# Altium project ICAN-7006-USB.PrjPCB
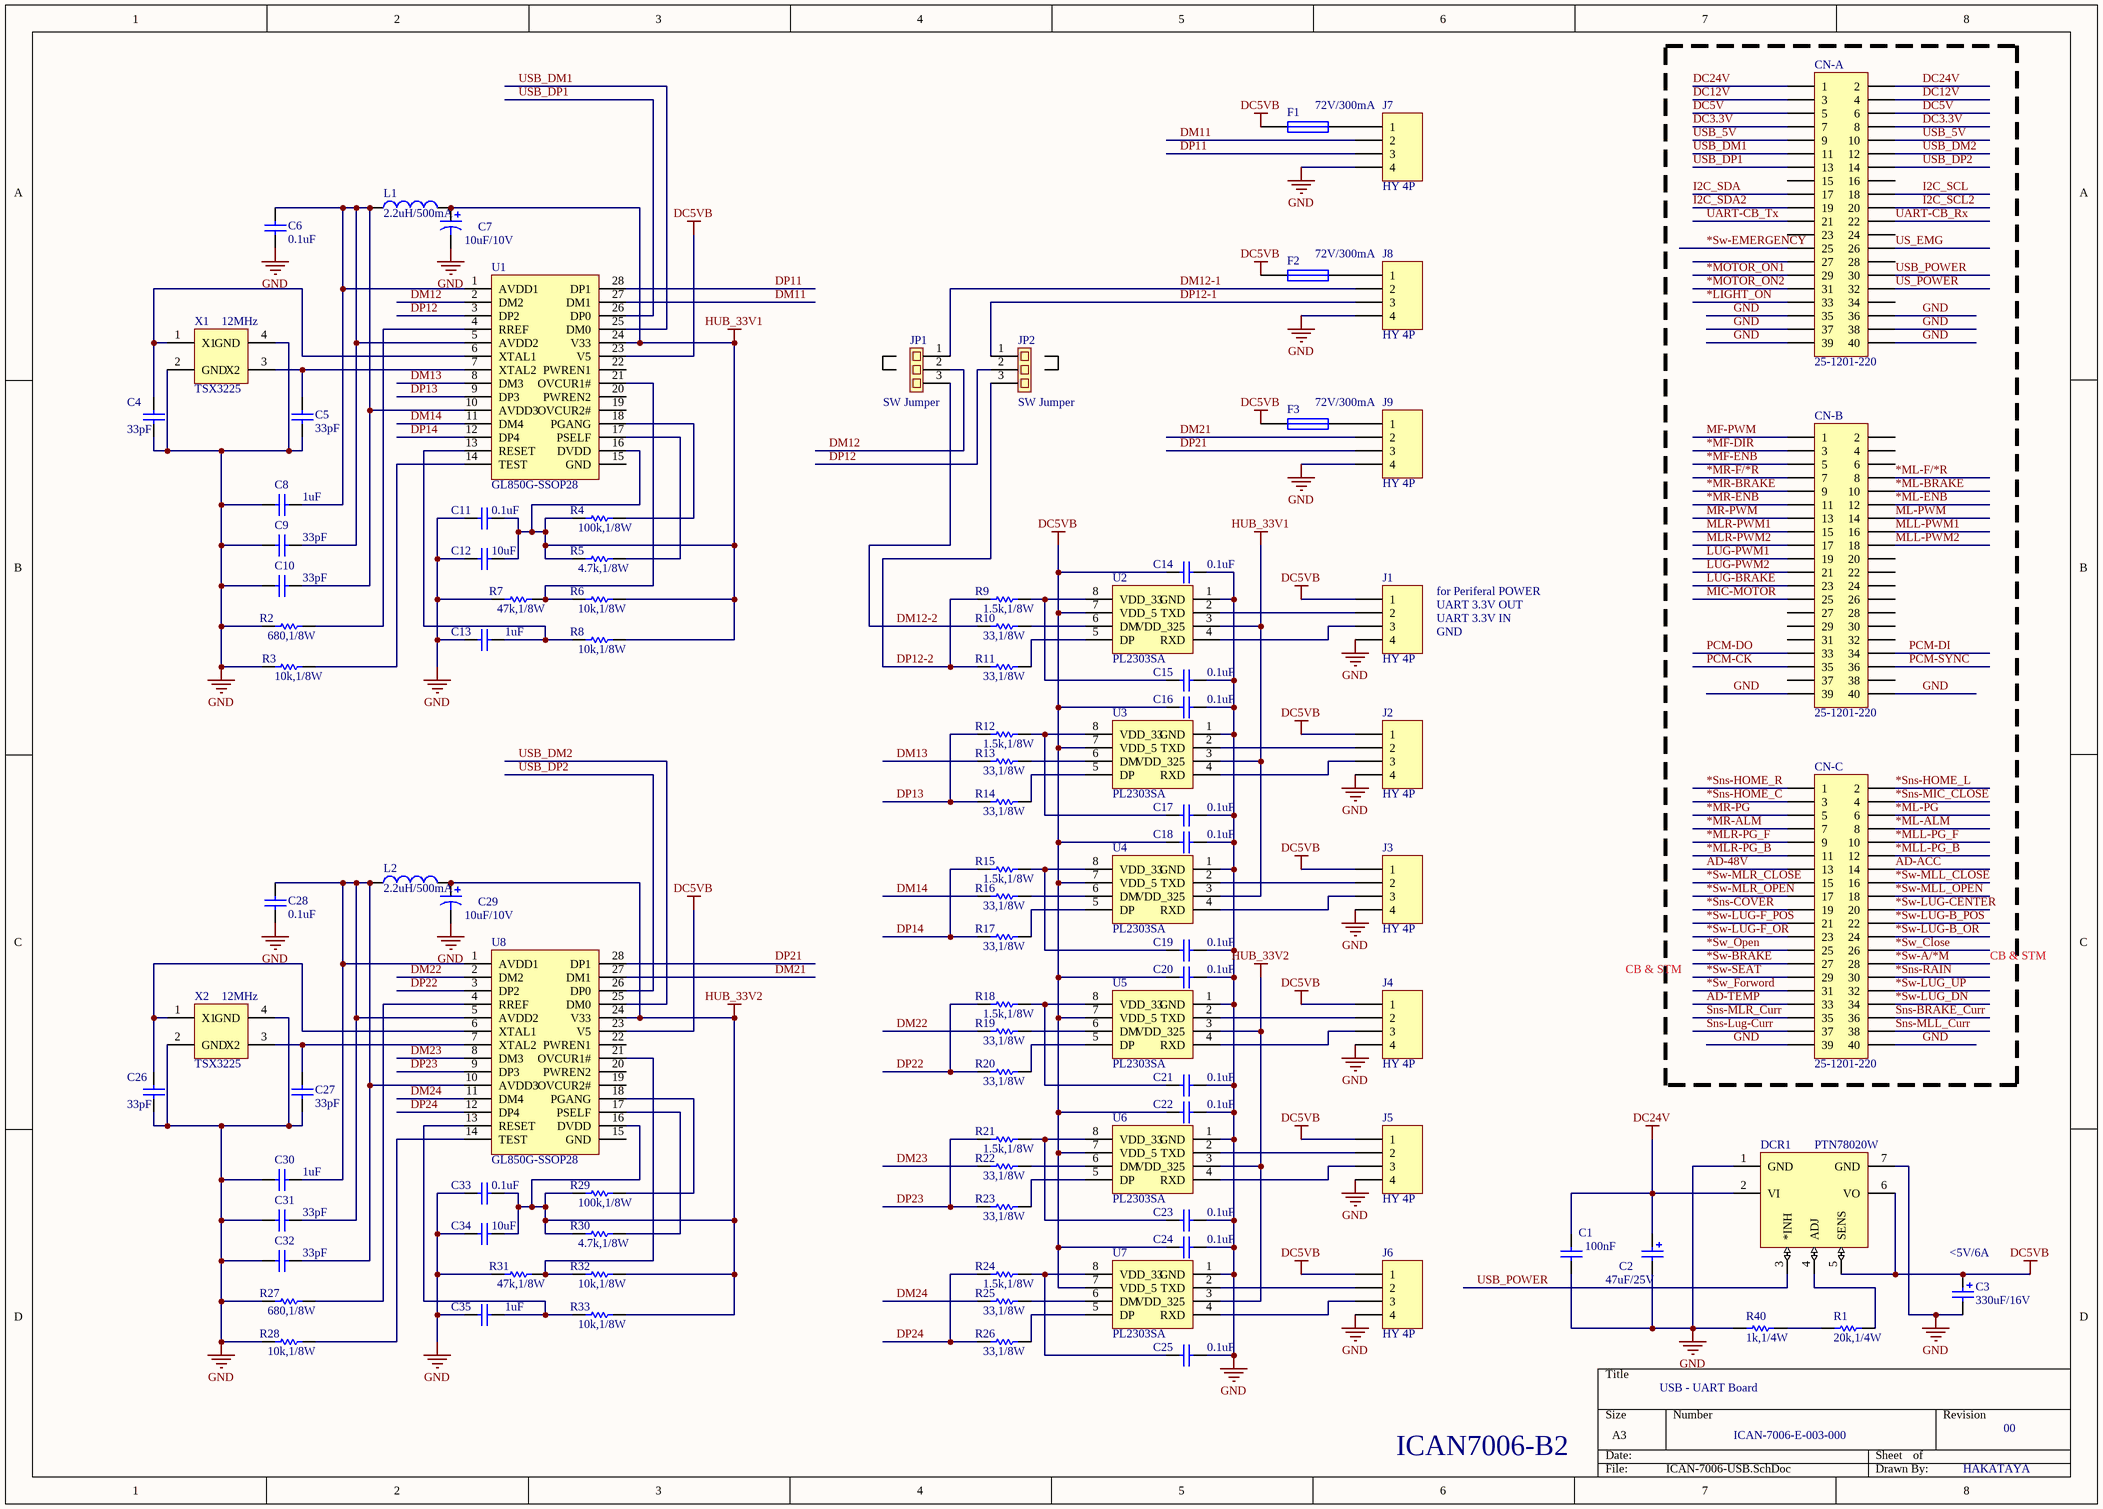
[diagram p0: ICAN-7006-USB.SchDoc]
1 sheet, 99 parts. Net scope: global (net labels, ports and power ports of the same name join across sheets).
Board file: ICAN-7006-USB.PcbDoc

## Sheet ICAN-7006-USB.SchDoc
size A3; PageSetup: Record=PageOptions|CenterHorizontal=True|CenterVertical=True|PrintScale=1.04|XCorrection=1.00|YCorrection=1.00|PrintKind=0|BorderSize=5000000|LeftOffset=0|BottomOffset=0|Orientation=2|PaperLength=1000|PaperWidth=1000|Scale=100|PaperSource=7|PrintQuality=-4|MediaType=1|DitherType=10|PaperKind=A3|PrintScaleMode=1

### Parts
C1  100nF  [[0805]2012]
C2  47uF/25V  [Capa MH5 PITCH2.5mm]
C3  330uF/16V  [CAPA WXA PITCH 3.5mm]
C4  33pF  [[0805]2012]
C5  33pF  [[0805]2012]
C6  0.1uF  [[0805]2012]
C7  10uF/10V  [[0805]2012]
C8  1uF  [[0805]2012]
C9  33pF  [[0805]2012]
C10  33pF  [[0805]2012]
C11  0.1uF  [[0805]2012]
C12  10uF  [[0805]2012]
C13  1uF  [[0805]2012]
C14  0.1uF  [[0805]2012]
C15  0.1uF  [[0805]2012]
C16  0.1uF  [[0805]2012]
C17  0.1uF  [[0805]2012]
C18  0.1uF  [[0805]2012]
C19  0.1uF  [[0805]2012]
C20  0.1uF  [[0805]2012]
C21  0.1uF  [[0805]2012]
C22  0.1uF  [[0805]2012]
C23  0.1uF  [[0805]2012]
C24  0.1uF  [[0805]2012]
C25  0.1uF  [[0805]2012]
C26  33pF  [[0805]2012]
C27  33pF  [[0805]2012]
C28  0.1uF  [[0805]2012]
C29  10uF/10V  [[0805]2012]
C30  1uF  [[0805]2012]
C31  33pF  [[0805]2012]
C32  33pF  [[0805]2012]
C33  0.1uF  [[0805]2012]
C34  10uF  [[0805]2012]
C35  1uF  [[0805]2012]
CN-A  25-1201-220  [HDR2X20]
CN-B  25-1201-220  [HDR2X20]
CN-C  25-1201-220  [HDR2X20]
DCR1  PTN78020W  [PTN78020]
F1  72V/300mA  [CAPR5-4X5]
F2  72V/300mA  [CAPR5-4X5]
F3  72V/300mA  [CAPR5-4X5]
J1  HY 4P  [HY-4AW]
J2  HY 4P  [HY-4AW]
J3  HY 4P  [HY-4AW]
J4  HY 4P  [HY-4AW]
J5  HY 4P  [HY-4AW]
J6  HY 4P  [HY-4AW]
J7  HY 4P  [HY-4AW]
J8  HY 4P  [HY-4AW]
J9  HY 4P  [HY-4AW]
JP1  SW Jumper  [VR]
JP2  SW Jumper  [VR]
L1  2.2uH/500mA  [[0805]2012]
L2  2.2uH/500mA  [[0805]2012]
R1  20k,1/4W  [[1206]3216]
R2  680,1/8W  [[0805]2012]
R3  10k,1/8W  [[0805]2012]
R4  100k,1/8W  [[0805]2012]
R5  4.7k,1/8W  [[0805]2012]
R6  10k,1/8W  [[0805]2012]
R7  47k,1/8W  [[0805]2012]
R8  10k,1/8W  [[0805]2012]
R9  1.5k,1/8W  [[0805]2012]
R10  33,1/8W  [[0805]2012]
R11  33,1/8W  [[0805]2012]
R12  1.5k,1/8W  [[0805]2012]
R13  33,1/8W  [[0805]2012]
R14  33,1/8W  [[0805]2012]
R15  1.5k,1/8W  [[0805]2012]
R16  33,1/8W  [[0805]2012]
R17  33,1/8W  [[0805]2012]
R18  1.5k,1/8W  [[0805]2012]
R19  33,1/8W  [[0805]2012]
R20  33,1/8W  [[0805]2012]
R21  1.5k,1/8W  [[0805]2012]
R22  33,1/8W  [[0805]2012]
R23  33,1/8W  [[0805]2012]
R24  1.5k,1/8W  [[0805]2012]
R25  33,1/8W  [[0805]2012]
R26  33,1/8W  [[0805]2012]
R27  680,1/8W  [[0805]2012]
R28  10k,1/8W  [[0805]2012]
R29  100k,1/8W  [[0805]2012]
R30  4.7k,1/8W  [[0805]2012]
R31  47k,1/8W  [[0805]2012]
R32  10k,1/8W  [[0805]2012]
R33  10k,1/8W  [[0805]2012]
R40  1k,1/4W  [[1206]3216]
U1  GL850G-SSOP28  [SSOP-28]
U2  PL2303SA  [SOIC150-8_L]
U3  PL2303SA  [SOIC150-8_L]
U4  PL2303SA  [SOIC150-8_L]
U5  PL2303SA  [SOIC150-8_L]
U6  PL2303SA  [SOIC150-8_L]
U7  PL2303SA  [SOIC150-8_L]
U8  GL850G-SSOP28  [SSOP-28]
X1  TSX3225  [XTAL 3225]
X2  TSX3225  [XTAL 3225]

### Blocks framed on the sheet
CB & STM: CN-A CN-B CN-C

### Nets
DC5VB: C3.1 C14.1 C16.1 C18.1 C20.1 C22.1 C24.1 DCR1.5(SENS) DCR1.6(VO) F1.1 F2.1 F3.1 J1.1 J2.1 J3.1 J4.1 J5.1 J6.1 U1.23(V5) U2.7(VDD_5) U3.7(VDD_5) U4.7(VDD_5) U5.7(VDD_5) U6.7(VDD_5) U7.7(VDD_5) U8.23(V5)
DC24V: C1.2 C2.1 CN-A.1 CN-A.2 DCR1.2(VI)
GND: C1.1 C2.2 C3.2 C4.1 C5.1 C6.1 C7.2 C8.1 C9.1 C10.1 C11.1 C12.1 C13.1 C14.2 C15.2 C16.2 C17.2 C18.2 C19.2 C20.2 C21.2 C22.2 C23.2 C24.2 C25.2 C26.1 C27.1 C28.1 C29.2 C30.1 C31.1 C32.1 C33.1 C34.1 C35.1 CN-A.35 CN-A.36 CN-A.37 CN-A.38 CN-A.39 CN-A.40 CN-B.39 CN-B.40 CN-C.39 CN-C.40 DCR1.1(GND) DCR1.7(GND) J1.4 J2.4 J3.4 J4.4 J5.4 J6.4 J7.4 J8.4 J9.4 R2.1 R3.1 R7.1 R27.1 R28.1 R31.1 R40.1 U2.1(GND) U3.1(GND) U4.1(GND) U5.1(GND) U6.1(GND) U7.1(GND) X1.2(GND) X1.4(GND) X2.2(GND) X2.4(GND)
HUB_33V1: C7.1 C11.2 C12.2 L1.2 R4.1 R5.1 R6.2 R8.2 U1.16(DVDD) U1.24(V33) U2.3(VDD_325) U3.3(VDD_325) U4.3(VDD_325)
HUB_33V2: C29.1 C33.2 C34.2 L2.2 R29.1 R30.1 R32.2 R33.2 U5.3(VDD_325) U6.3(VDD_325) U7.3(VDD_325) U8.16(DVDD) U8.24(V33)
*LIGHT_ON: CN-A.33
*MF-DIR: CN-B.3
*MF-ENB: CN-B.5
*ML-ALM: CN-C.8
*ML-BRAKE: CN-B.10
*ML-ENB: CN-B.12
*ML-F/*R: CN-B.8
*ML-PG: CN-C.6
*MLL-PG_B: CN-C.12
*MLL-PG_F: CN-C.10
*MLR-PG_B: CN-C.11
*MLR-PG_F: CN-C.9
*MOTOR_ON1: CN-A.29
*MOTOR_ON2: CN-A.31
*MR-ALM: CN-C.7
*MR-BRAKE: CN-B.9
*MR-ENB: CN-B.11
*MR-F/*R: CN-B.7
*MR-PG: CN-C.5
*Sns-COVER: CN-C.19
*Sns-HOME_C: CN-C.3
*Sns-HOME_L: CN-C.2
*Sns-HOME_R: CN-C.1
*Sns-MIC_CLOSE: CN-C.4
*Sns-RAIN: CN-C.30
*Sw-A/*M: CN-C.28
*Sw-BRAKE: CN-C.27
*Sw-EMERGENCY: CN-A.25
*Sw-LUG-B_OR: CN-C.24
*Sw-LUG-B_POS: CN-C.22
*Sw-LUG-CENTER: CN-C.20
*Sw-LUG-F_OR: CN-C.23
*Sw-LUG-F_POS: CN-C.21
*Sw-LUG_DN: CN-C.34
*Sw-LUG_UP: CN-C.32
*Sw-MLL_CLOSE: CN-C.16
*Sw-MLL_OPEN: CN-C.18
*Sw-MLR_CLOSE: CN-C.15
*Sw-MLR_OPEN: CN-C.17
*Sw-SEAT: CN-C.29
*Sw_Close: CN-C.26
*Sw_Forword: CN-C.31
*Sw_Open: CN-C.25
AD-48V: CN-C.13
AD-ACC: CN-C.14
AD-TEMP: CN-C.33
DC3.3V: CN-A.7 CN-A.8
DC5V: CN-A.5 CN-A.6
DC12V: CN-A.3 CN-A.4
DM11: J7.2 U1.27(DM1)
DM12: JP1.2 U1.2(DM2)
DM12-1: J8.2 JP1.1
DM12-2: JP1.3 R10.1
DM13: R13.1 U1.8(DM3)
DM14: R16.1 U1.11(DM4)
DM21: J9.2 U8.27(DM1)
DM22: R19.1 U8.2(DM2)
DM23: R22.1 U8.8(DM3)
DM24: R25.1 U8.11(DM4)
DP11: J7.3 U1.28(DP1)
DP12: JP2.2 U1.3(DP2)
DP12-1: J8.3 JP2.1
DP12-2: JP2.3 R9.1 R11.1
DP13: R12.1 R14.1 U1.9(DP3)
DP14: R15.1 R17.1 U1.12(DP4)
DP21: J9.3 U8.28(DP1)
DP22: R18.1 R20.1 U8.3(DP2)
DP23: R21.1 R23.1 U8.9(DP3)
DP24: R24.1 R26.1 U8.12(DP4)
I2C_SCL: CN-A.18
I2C_SCL2: CN-A.20
I2C_SDA: CN-A.17
I2C_SDA2: CN-A.19
LUG-BRAKE: CN-B.23
LUG-PWM1: CN-B.19
LUG-PWM2: CN-B.21
MF-PWM: CN-B.1
MIC-MOTOR: CN-B.25
ML-PWM: CN-B.14
MLL-PWM1: CN-B.16
MLL-PWM2: CN-B.18
MLR-PWM1: CN-B.15
MLR-PWM2: CN-B.17
MR-PWM: CN-B.13
PCM-CK: CN-B.35
PCM-DI: CN-B.34
PCM-DO: CN-B.33
PCM-SYNC: CN-B.36
Sns-BRAKE_Curr: CN-C.36
Sns-Lug-Curr: CN-C.37
Sns-MLL_Curr: CN-C.38
Sns-MLR_Curr: CN-C.35
UART-CB_Rx: CN-A.22
UART-CB_Tx: CN-A.21
US_EMG: CN-A.26
US_POWER: CN-A.32
USB_5V: CN-A.9 CN-A.10
USB_DM1: CN-A.11 U1.25(DM0)
USB_DM2: CN-A.12 U8.25(DM0)
USB_DP1: CN-A.13 U1.26(DP0)
USB_DP2: CN-A.14 U8.26(DP0)
USB_POWER: CN-A.30 DCR1.3(*INH)
NetC4_2: C4.2 U1.6(XTAL1) X1.1(X1)
NetC5_2: C5.2 U1.7(XTAL2) X1.3(X2)
NetC6_2: C6.2 C8.2 C9.2 C10.2 L1.1 U1.1(AVDD1) U1.5(AVDD2) U1.10(AVDD3)
NetC13_2: C13.2 R8.1 U1.13(RESET)
NetC15_1: C15.1 R9.2 U2.8(VDD_33)
NetC17_1: C17.1 R12.2 U3.8(VDD_33)
NetC19_1: C19.1 R15.2 U4.8(VDD_33)
NetC21_1: C21.1 R18.2 U5.8(VDD_33)
NetC23_1: C23.1 R21.2 U6.8(VDD_33)
NetC25_1: C25.1 R24.2 U7.8(VDD_33)
NetC26_2: C26.2 U8.6(XTAL1) X2.1(X1)
NetC27_2: C27.2 U8.7(XTAL2) X2.3(X2)
NetC28_2: C28.2 C30.2 C31.2 C32.2 L2.1 U8.1(AVDD1) U8.5(AVDD2) U8.10(AVDD3)
NetC35_2: C35.2 R33.1 U8.13(RESET)
NetDCR1_4: DCR1.4(ADJ) R1.2
NetF1_2: F1.2 J7.1
NetF2_2: F2.2 J8.1
NetF3_2: F3.2 J9.1
NetJ1_2: J1.2 U2.2(TXD)
NetJ1_3: J1.3 U2.4(RXD)
NetJ2_2: J2.2 U3.2(TXD)
NetJ2_3: J2.3 U3.4(RXD)
NetJ3_2: J3.2 U4.2(TXD)
NetJ3_3: J3.3 U4.4(RXD)
NetJ4_2: J4.2 U5.2(TXD)
NetJ4_3: J4.3 U5.4(RXD)
NetJ5_2: J5.2 U6.2(TXD)
NetJ5_3: J5.3 U6.4(RXD)
NetJ6_2: J6.2 U7.2(TXD)
NetJ6_3: J6.3 U7.4(RXD)
NetR1_1: R1.1 R40.2
NetR2_2: R2.2 U1.4(RREF)
NetR3_2: R3.2 U1.14(TEST)
NetR4_2: R4.2 U1.18(PGANG)
NetR5_2: R5.2 U1.17(PSELF)
NetR6_1: R6.1 R7.2 U1.21(OVCUR1#)
NetR10_2: R10.2 U2.6(DM)
NetR11_2: R11.2 U2.5(DP)
NetR13_2: R13.2 U3.6(DM)
NetR14_2: R14.2 U3.5(DP)
NetR16_2: R16.2 U4.6(DM)
NetR17_2: R17.2 U4.5(DP)
NetR19_2: R19.2 U5.6(DM)
NetR20_2: R20.2 U5.5(DP)
NetR22_2: R22.2 U6.6(DM)
NetR23_2: R23.2 U6.5(DP)
NetR25_2: R25.2 U7.6(DM)
NetR26_2: R26.2 U7.5(DP)
NetR27_2: R27.2 U8.4(RREF)
NetR28_2: R28.2 U8.14(TEST)
NetR29_2: R29.2 U8.18(PGANG)
NetR30_2: R30.2 U8.17(PSELF)
NetR31_2: R31.2 R32.1 U8.21(OVCUR1#)

Not connected (* = marked no-connect by the designer): CN-A 15 16 23 24 27 28 34; CN-B 2 4 6 20 22 24 26 27 28 29 30 31 32 37 38; U1 15(GND) 19(OVCUR2#) 20(PWREN2) 22(PWREN1); U8 15(GND) 19(OVCUR2#) 20(PWREN2) 22(PWREN1)

### Notes on the sheet
- (near X1) 12MHz
- for Periferal POWER
- UART 3.3V IN
- UART 3.3V OUT
- GND
- CB & STM
- (near X2) 12MHz
- (near C3) <5V/6A
- USB - UART Board
- ICAN7006-B2
- ICAN-7006-E-003-000
- 00
- HAKATAYA

### Library data of the parts
C1 = Cap: Capacitor; Published: 8-Jun-2000; LatestRevisionDate: 17-Jul-2002; LatestRevisionNote: Re-released for DXP Platform.; PackageReference: RAD-0.3; Publisher: Altium Limited; Value: 100nF
C2 C3 = Cap Pol2: Polarized Capacitor (Axial); Published: 8-Jun-2000; LatestRevisionDate: 17-Jul-2002; LatestRevisionNote: Re-released for DXP Platform.; PackageReference: POLAR0.8; Publisher: Altium Limited
  C2: Value: 47uF/25V; Supplier Part Number: MH5 47uF/25V
  C3: Value: 330uF/16V; Supplier Part Number: WXA 330uF/25V
C4-C6 C8-C10 C13-C28 C30-C32 C35 = Cap Semi: Capacitor; Published: 8-Jun-2000; LatestRevisionDate: 17-Jul-2002; LatestRevisionNote: Re-released for DXP Platform.; PackageReference: C1206; Publisher: Altium Limited
  C4 C5 C9 C10 C26 C27 C31 C32: Value: 33pF
  C6 C14-C25 C28: Value: 0.1uF
  C8 C13 C30 C35: Value: 1uF
C7 C29 = Cap Pol3: Polarized Capacitor (Surface Mount); Published: 8-Jun-2000; LatestRevisionDate: 17-Jul-2002; LatestRevisionNote: Re-released for DXP Platform.; PackageReference: C0805; Publisher: Altium Limited; Value: 10uF/10V
C11 C12 C33 C34 = Cap Semi: Capacitor; Value: 1uF; Published: 8-Jun-2000; LatestRevisionDate: 17-Jul-2002; LatestRevisionNote: Re-released for DXP Platform.; PackageReference: C1206; Publisher: Altium Limited
CN-A CN-B CN-C = Header 20X2: Header, 20-Pin, Dual row; LatestRevisionDate: 17-Jul-2002; LatestRevisionNote: Re-released for DXP Platform.; Publisher: Altium Limited; Supplier: Astron Corporation.; URL: http://www.astron.com.tw/product.php?idt=1&pid=68&pno=212; Supplier Part Number: 25-1201-220
DCR1 = PTN78020: REGURATOR; Supplier Part Number: PTN7820W
F1-F3 = Fuse 1: Fuse; Published: 8-Jun-2000; LatestRevisionDate: 17-Jul-2002; LatestRevisionNote: Re-released for DXP Platform.; PackageReference: PIN-W2/E2.8; Publisher: Altium Limited; Supplier Part Number: RXEF030
J1-J9 = Header 4: Header, 4-Pin; LatestRevisionDate: 17-Jul-2002; LatestRevisionNote: Re-released for DXP Platform.; Publisher: Altium Limited; Supplier Part Number: A2006-04AW; Supplier: YOLINK
JP1 JP2 = SW Jumper: Jumper
L1 L2 = Inductor: Code_IEC: 1005; Published: 8-Jun-2000; LatestRevisionDate: 17-Jul-2002; LatestRevisionNote: Re-released for DXP Platform.; PackageReference: 0402-A; Publisher: Altium Limited; Code_JEITA: 0402; URL: *; Supplier Part Number: MLZ1608N2R2; Value: 2.2uH/500mA
R1-R13 R15-R33 R40 = Res1: Resistor; Published: 8-Jun-2000; LatestRevisionDate: 17-Jul-2002; LatestRevisionNote: Re-released for DXP Platform.; PackageReference: AXIAL-0.3; Publisher: Altium Limited
  R1: Value: 20k,1/4W
  R2 R27: Value: 680,1/8W
  R3 R6 R8 R28 R32 R33: Value: 10k,1/8W
  R4 R29: Value: 100k,1/8W
  R5 R30: Value: 4.7k,1/8W
  R7 R31: Value: 47k,1/8W
  R9 R12 R15 R18 R21 R24: Value: 1.5k,1/8W
  R10 R11 R13 R16 R17 R19 R20 R22 R23 R25 R26: Value: 33,1/8W
  R40: Value: 1k,1/4W
R14 = Res1: Resistor; Value: 33k,1/8W; Published: 8-Jun-2000; LatestRevisionDate: 17-Jul-2002; LatestRevisionNote: Re-released for DXP Platform.; PackageReference: AXIAL-0.3; Publisher: Altium Limited
U1 = IC28: HUB Controller; Supplier Part Number: GL850G-SSOP28
U2-U7 = IC8-WIDE: Serial Bridge; Supplier Part Number: PL2303SA
U8 = IC28: Supplier Part Number: GL850G-SSOP28
X1 X2 = IC4 WIDE: Crystal Oscillator; Value: 12MHz; Supplier Part Number: TSX3225